# Altium schematic sheet small_matrix_ws2812_LEDs.SchDoc
size A; SheetNumber: 1; SheetTotal: 2
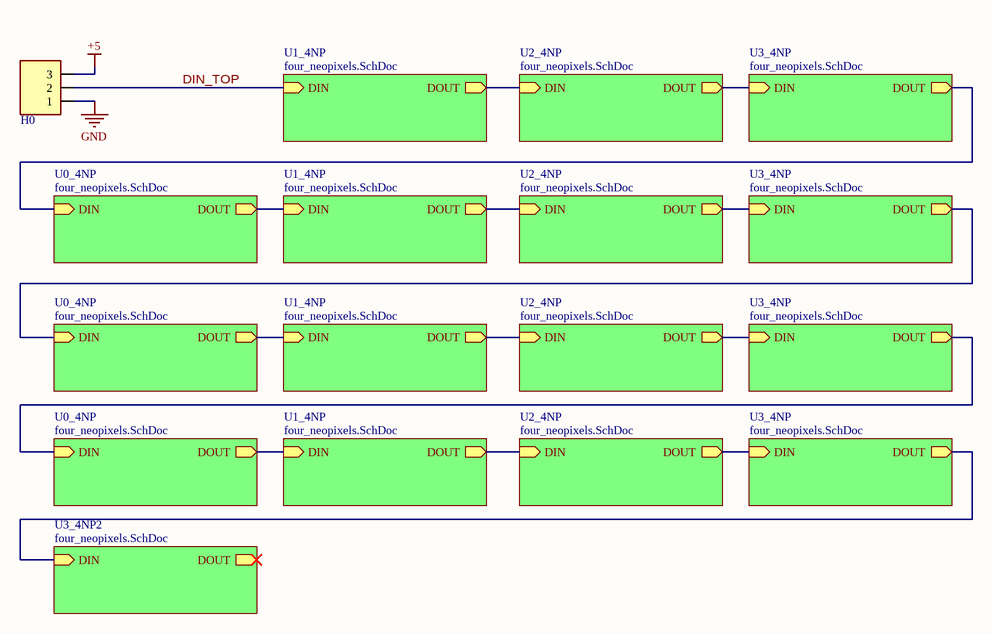
[diagram p0: small_matrix_ws2812_LEDs.SchDoc]

## Parts
H0  1x3 Male  [[No Series] Shrouded 1x3]  (value not drawn)

## Sub-sheets
U0_4NP = four_neopixels.SchDoc: DIN (in), DOUT (out)
U0_4NP = four_neopixels.SchDoc: DIN (in), DOUT (out)
U0_4NP = four_neopixels.SchDoc: DIN (in), DOUT (out)
U1_4NP = four_neopixels.SchDoc: DIN (in), DOUT (out)
U1_4NP = four_neopixels.SchDoc: DIN (in), DOUT (out)
U1_4NP = four_neopixels.SchDoc: DIN (in), DOUT (out)
U1_4NP = four_neopixels.SchDoc: DIN (in), DOUT (out)
U2_4NP = four_neopixels.SchDoc: DIN (in), DOUT (out)
U2_4NP = four_neopixels.SchDoc: DIN (in), DOUT (out)
U2_4NP = four_neopixels.SchDoc: DIN (in), DOUT (out)
U2_4NP = four_neopixels.SchDoc: DIN (in), DOUT (out)
U3_4NP = four_neopixels.SchDoc: DIN (in), DOUT (out)
U3_4NP = four_neopixels.SchDoc: DIN (in), DOUT (out)
U3_4NP = four_neopixels.SchDoc: DIN (in), DOUT (out)
U3_4NP = four_neopixels.SchDoc: DIN (in), DOUT (out)
U3_4NP2 = four_neopixels.SchDoc: DIN (in), DOUT (out)

## Nets
+5: H0.3
GND: H0.1
DIN_TOP: H0.2 ; sheet U1_4NP/DIN
(unnamed): sheet U1_4NP/DOUT, sheet U2_4NP/DIN
(unnamed): sheet U2_4NP/DOUT, sheet U3_4NP/DIN
(unnamed): sheet U3_4NP/DOUT, sheet U0_4NP/DIN
(unnamed): sheet U0_4NP/DOUT, sheet U1_4NP/DIN
(unnamed): sheet U1_4NP/DOUT, sheet U2_4NP/DIN
(unnamed): sheet U2_4NP/DOUT, sheet U3_4NP/DIN
(unnamed): sheet U3_4NP/DOUT, sheet U0_4NP/DIN
(unnamed): sheet U0_4NP/DOUT, sheet U1_4NP/DIN
(unnamed): sheet U1_4NP/DOUT, sheet U2_4NP/DIN
(unnamed): sheet U2_4NP/DOUT, sheet U3_4NP/DIN
(unnamed): sheet U3_4NP/DOUT, sheet U0_4NP/DIN
(unnamed): sheet U0_4NP/DOUT, sheet U1_4NP/DIN
(unnamed): sheet U1_4NP/DOUT, sheet U2_4NP/DIN
(unnamed): sheet U2_4NP/DOUT, sheet U3_4NP/DIN
(unnamed): sheet U3_4NP/DOUT, sheet U3_4NP2/DIN

## Notes on the sheet
- Project/Vehicle:
- Author(s):
- -
- Revisor(s):
- Git Repo:
- Git Hash:
- Date:
- Revision:
- Size:
- A
- File:
- Sheet
- of

## Library data of the parts
H0 = [No Series] Shrouded 1x3: 1778777; Supplier 1: DigiKey; Supplier Part Number 1: 277-2316-1-ND